# Altium schematic sheet PortSplitters.SCHDOC
size A; Organization: Altium Limited; Address1: L3, 12a Rodborough Rd; Address2: Frenchs Forest; Address3: NSW; Address4: Australia 2086; DocumentNumber: 2; SheetNumber: 2; SheetTotal: 2
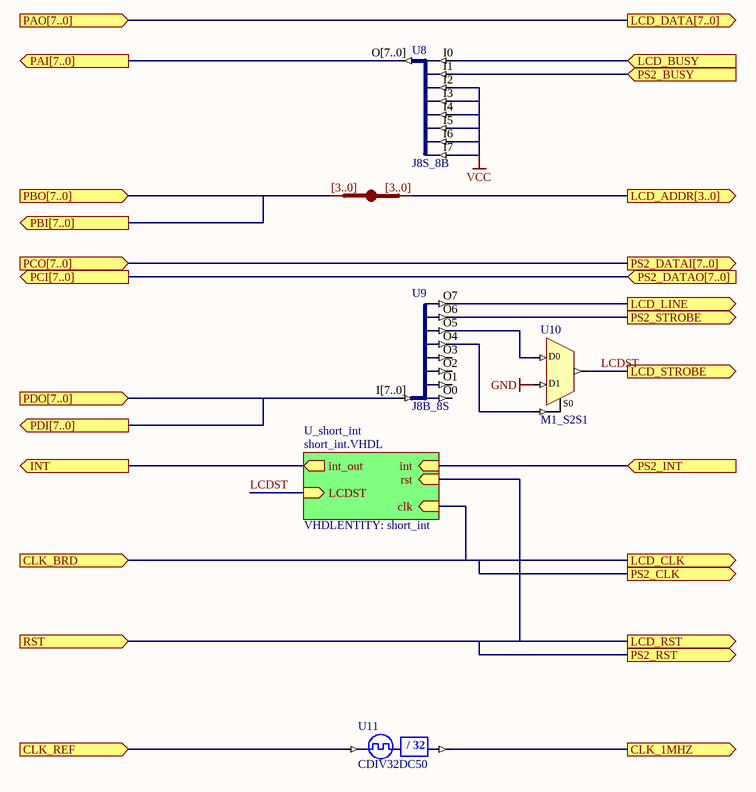
[diagram p0: PortSplitters.SCHDOC]

## Parts
JB_S1  IndexA: [3..0]  (hidden comment: JB)
U8  J8S_8B
U9  J8B_8S
U10  M1_S2S1
U11  CDIV32DC50

## Sub-sheets
U_short_int = short_int.VHDL: clk (in), int (in), int_out (out), rst (in), LCDST (in)  | VHDLENTITY: short_int

## Ports
CLK_1MHZ (out), CLK_BRD (in), CLK_REF (in), INT (out), LCD_ADDR[3..0] (out), LCD_BUSY (in), LCD_CLK (out), LCD_DATA[7..0] (out), LCD_LINE (out), LCD_RST (out), LCD_STROBE (out), PAI[7..0] (out), PAO[7..0] (in), PBI[7..0] (out), PBO[7..0] (in), PCI[7..0] (out), PCO[7..0] (in), PDI[7..0] (out), PDO[7..0] (in), PS2_BUSY (in), PS2_CLK (out), PS2_DATAI[7..0] (out), PS2_DATAO[7..0] (in), PS2_INT (in), PS2_RST (out), PS2_STROBE (out), RST (in)

## Nets
GND: U10.D1
VCC: U8.I2 U8.I3 U8.I4 U8.I5 U8.I6 U8.I7
CLK_1MHZ: U11.CLKDV ; port CLK_1MHZ
CLK_BRD: port CLK_BRD, port LCD_CLK, port PS2_CLK, sheet U_short_int/clk
CLK_REF: U11.CLKIN ; port CLK_REF
INT: port INT, sheet U_short_int/int_out
LCD_ADDR[3..0]: JB_S1.B[0..0] ; port LCD_ADDR[3..0]
LCD_BUSY: U8.I0 ; port LCD_BUSY
LCD_LINE: U9.O7 ; port LCD_LINE
LCD_RST: port RST, port LCD_RST, port PS2_RST, sheet U_short_int/rst
LCDST: U10.O ; port LCD_STROBE, sheet U_short_int/LCDST
PAI[7..0]: U8.O[7..0] ; port PAI[7..0]
PBI[7..0]: JB_S1.A[0..0] ; port PBO[7..0], port PBI[7..0]
PDI[7..0]: U9.I[7..0] ; port PDO[7..0], port PDI[7..0]
PS2_BUSY: U8.I1 ; port PS2_BUSY
PS2_INT: port PS2_INT, sheet U_short_int/int
PS2_STROBE: U9.O6 ; port PS2_STROBE
NetU9_O4: U9.O4 U10.S0
NetU9_O5: U9.O5 U10.D0

Not connected (* = marked no-connect by the designer): U9 O0 O1 O2 O3

## Buses and harness runs
bus port LCD_DATA[7..0] = port PAO[7..0]
bus port PBI[7..0] = port PBO[7..0]
bus port PCI[7..0] = port PS2_DATAO[7..0]
bus port PCO[7..0] = port PS2_DATAI[7..0]
bus port PDI[7..0] = port PDO[7..0]

## Notes on the sheet
- Title
- Size:
- Date:
- A
- Number:
- Time:
- Revision:
- Sheet
- of
- File:
- (in symbol CDIV32DC50) / 32

## Library data of the parts
JB_S1 = JB: System BUS Joiner; ArchiveName: GENERIC; VHDLIB_SIM: GENERIC_LIB; Published: 29-Jan-2004; Publisher: Altium Limited; Core Revision: 1.00.00; IndexB: [3..0]
U8 = J8S_8B: 8 Single pin inputs to single 8-Bit output bus; ArchiveName: GENERIC; VHDLIB_SIM: GENERIC_LIB; Published: 29-Jan-2004; Publisher: Altium Limited; Core Revision: 1.00.00
U9 = J8B_8S: 8-Bit input bus to 8 single pin outputs; ArchiveName: GENERIC; VHDLIB_SIM: GENERIC_LIB; Published: 29-Jan-2004; Publisher: Altium Limited; Core Revision: 1.00.00
U10 = M1_S2S1: 2x1-Single Wire to 1x1-Single Wire Multiplexer; Xilinx Equivalent: M2_1; ArchiveName: GENERIC; VHDLIB_SIM: GENERIC_LIB; Published: 28-Jan-2004; Publisher: Altium Limited; Core Revision: 1.00.00
U11 = CDIV32DC50: Clock Divider by 32 with 50% Duty Cycle Output; ArchiveName: GENERIC; VHDLIB_SIM: GENERIC_LIB; Published: 29-Jan-2004; Publisher: Altium Limited; Core Revision: 1.00.00